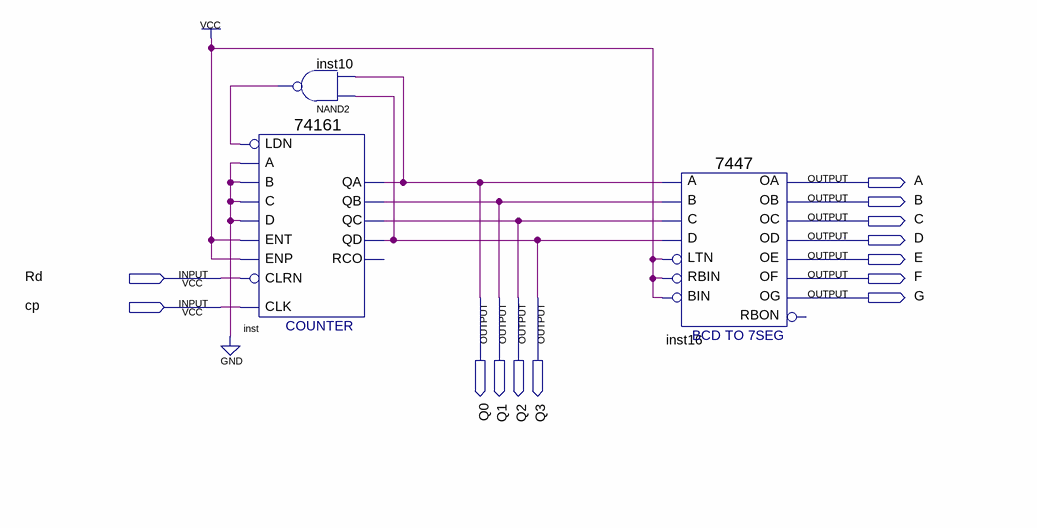
[diagram p0: schematic sheet]
// Quartus schematic test0514.bdf as structural Verilog: 3 symbols, 13 pins
module test0514 (
  input  Rd,
  input  cp,
  output A,
  output B,
  output C,
  output D,
  output E,
  output F,
  output Q0,
  output Q1,
  output Q2,
  output Q3,
  output G
);

  wire inst10_out;

  \74161  inst (
    .CLRN(Rd), .CLK(cp), .ENP(1'b1), .LDN(inst10_out), .A(1'b0), .D(1'b0), .ENT(1'b1), .B(1'b0), .C(1'b0),
    .QD(Q3), .QC(Q2), .QB(Q1), .QA(Q0));  // open: RCO
  nand inst10 (inst10_out, Q3, Q0);
  \7447  inst16 (
    .LTN(1'b1), .B(Q1), .C(Q2), .D(Q3), .RBIN(1'b1), .BIN(1'b1), .A(Q0), .OB(B), .OC(C), .OE(E), .OD(D),
    .OF(F), .OG(G), .OA(A));  // open: RBON
endmodule
